# EAGLE design one_sided_standalone_DWM1000 (EAGLE 6.2)
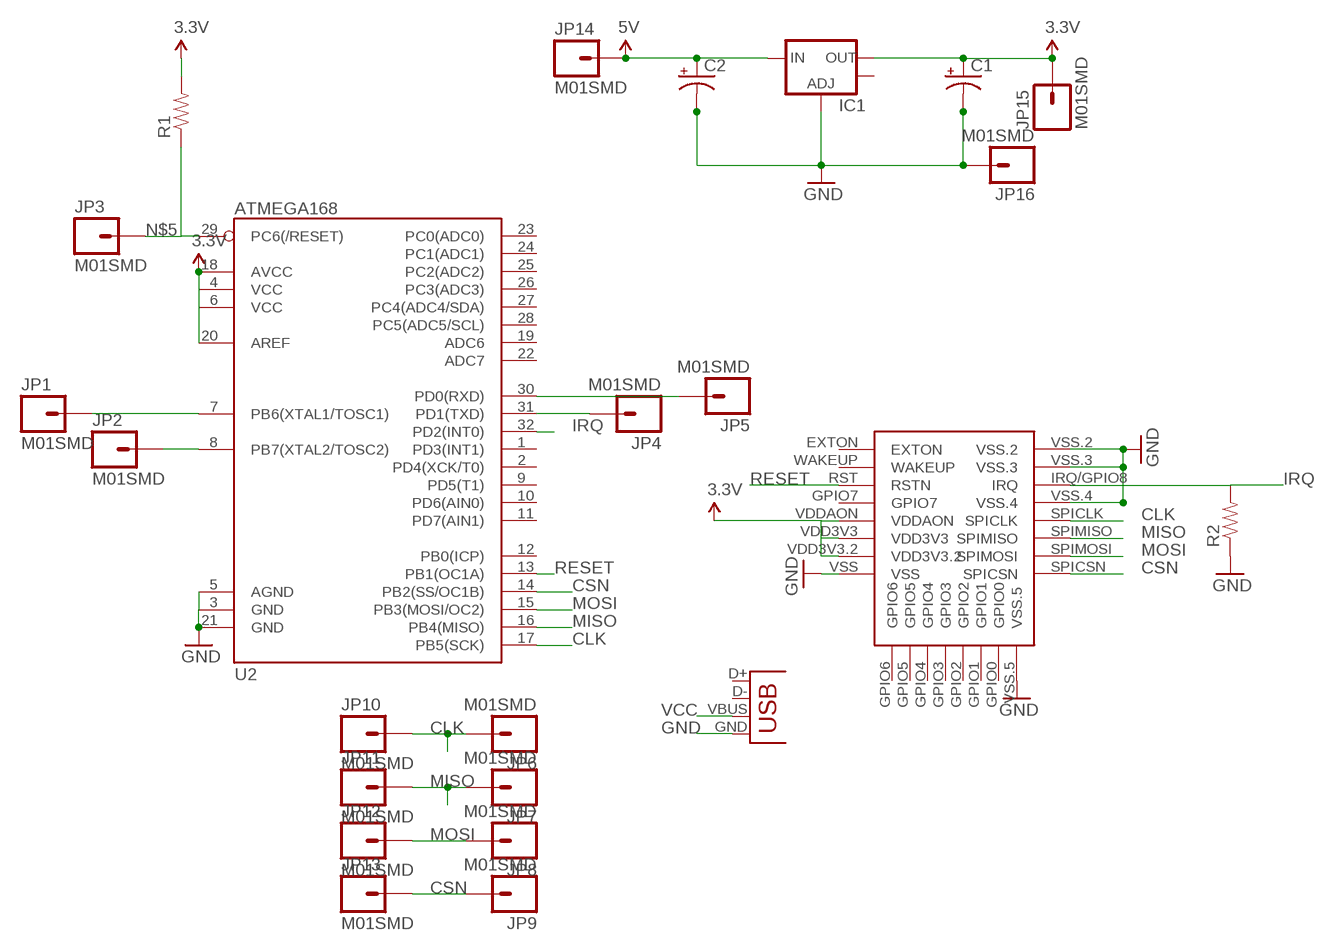
[diagram p0: schematic, sheet 1]

## Parts
C1  CAP_POL3528-KIT  [EIA3528-KIT]
C2  CAP_POL3528-KIT  [EIA3528-KIT]
IC1  V_REG_LM1117SOT223  [SOT223]
JP1  M01SMD  [LUXEON-PAD]
JP2  M01SMD  [LUXEON-PAD]
JP3  M01SMD  [LUXEON-PAD]
JP4  M01SMD  [LUXEON-PAD]
JP5  M01SMD  [LUXEON-PAD]
JP6  M01SMD  [LUXEON-PAD]
JP7  M01SMD  [LUXEON-PAD]
JP8  M01SMD  [LUXEON-PAD]
JP9  M01SMD  [LUXEON-PAD]
JP10  M01SMD  [LUXEON-PAD]
JP11  M01SMD  [LUXEON-PAD]
JP12  M01SMD  [LUXEON-PAD]
JP13  M01SMD  [LUXEON-PAD]
JP14  M01SMD  [LUXEON-PAD]
JP15  M01SMD  [LUXEON-PAD]
JP16  M01SMD  [LUXEON-PAD]
R1  RESISTOR0805-RES  [0805]
R2  RESISTOR0805-RES  [0805]
U2  ATMEGA168  [TQFP32-08]
U$1  DWM1000  [DWM1000]
X1  USB-MICROB  [USB-MICROB]

## Nets
CLK: JP6.P$1 JP10.P$1 U2.17(PB5(SCK)) U$1.SPICLK
CSN: JP9.P$1 JP13.P$1 U2.14(PB2(SS/OC1B)) U$1.SPICSN
GND: C1.C(-) C2.C(-) IC1.1(ADJ) JP16.P$1 R2.1 U2.3(GND) U2.5(AGND) U2.21(GND) U$1.VSS U$1.VSS.2 U$1.VSS.3 U$1.VSS.4 U$1.VSS.5 X1.GND
IRQ: R2.2 U2.32(PD2(INT0)) U$1.IRQ/GPIO8(IRQ)
MISO: JP7.P$1 JP11.P$1 U2.16(PB4(MISO)) U$1.SPIMISO
MOSI: JP8.P$1 JP12.P$1 U2.15(PB3(MOSI/OC2)) U$1.SPIMOSI
N$1: JP1.P$1 U2.7(PB6(XTAL1/TOSC1))
N$2: JP2.P$1 U2.8(PB7(XTAL2/TOSC2))
N$5: JP3.P$1 R1.1 U2.29(PC6(/RESET))
N$6: JP4.P$1 U2.31(PD1(TXD))
N$7: JP5.P$1 U2.30(PD0(RXD))
RESET: U2.13(PB1(OC1A)) U$1.RST(RSTN)
VCC: C2.A(+) IC1.3(IN) JP14.P$1 X1.VBUS ; supply symbol labelled 5V
VCC3.3: C1.A(+) IC1.2(OUT) JP15.P$1 R1.2 U2.6(VCC) U2.18(AVCC) U2.20(AREF) U$1.VDD3V3 U$1.VDD3V3.2 U$1.VDDAON ; supply symbol labelled 3.3V
Unconnected: IC1.4(OUT) U2.1(PD3(INT1)) U2.2(PD4(XCK/T0)) U2.4(VCC) U2.9(PD5(T1)) U2.10(PD6(AIN0)) U2.11(PD7(AIN1)) U2.12(PB0(ICP)) U2.19(ADC6) U2.22(ADC7) U2.23(PC0(ADC0)) U2.24(PC1(ADC1)) U2.25(PC2(ADC2)) U2.26(PC3(ADC3)) U2.27(PC4(ADC4/SDA)) U2.28(PC5(ADC5/SCL)) U$1.EXTON U$1.GPIO0 U$1.GPIO1 U$1.GPIO2 U$1.GPIO3 U$1.GPIO4 U$1.GPIO5 U$1.GPIO6 U$1.GPIO7 U$1.WAKEUP X1.D+ X1.D-

## Library data of the parts
C1 C2 = SparkFun:CAP_POL: Capacitor Polarized These are standard SMD and PTH capacitors. Normally 10uF, 47uF, and 100uF in electrolytic and tantalum varieties. Always verify the external diameter of the through hole cap, it varies with capacity, voltage, and manufacturer. The EIA devices should be standard.
IC1 = SparkFun:V_REG_LM1117: Voltage Regulator LM1117 Standard adjustable voltage regulator but in SMD form. Spark Fun Electronics SKU : COM-00595
JP1-JP16 = SparkFun:M01: Header 1 Standard 1-pin 0.1" header. Use with straight break away headers (SKU : PRT-00116), right angle break away headers (PRT-00553), swiss pins (PRT-00743), machine pins (PRT-00117), and female headers (PRT-00115).
R1 R2 = SparkFun:RESISTOR: Resistor Basic schematic elements and footprints for 0603, 1206, and PTH resistors.
U2 = SparkFun:ATMEGA168
U$1 = DWM1000:DWM1000
X1 = SparkFun:USB: USB Connectors USB-B-PTH is fully proven SKU : PRT-00139 USB-miniB is fully proven SKU : PRT-00587 USB-A-PCB is untested. USB-A-H is throughly reviewed, but untested. Spark Fun Electronics SKU : PRT-00437 USB-B-SMT is throughly reviewed, but untested. Needs silkscreen touching up. USB-A-S has not been used/tested USB-MB-H has not been used/tested

## Board
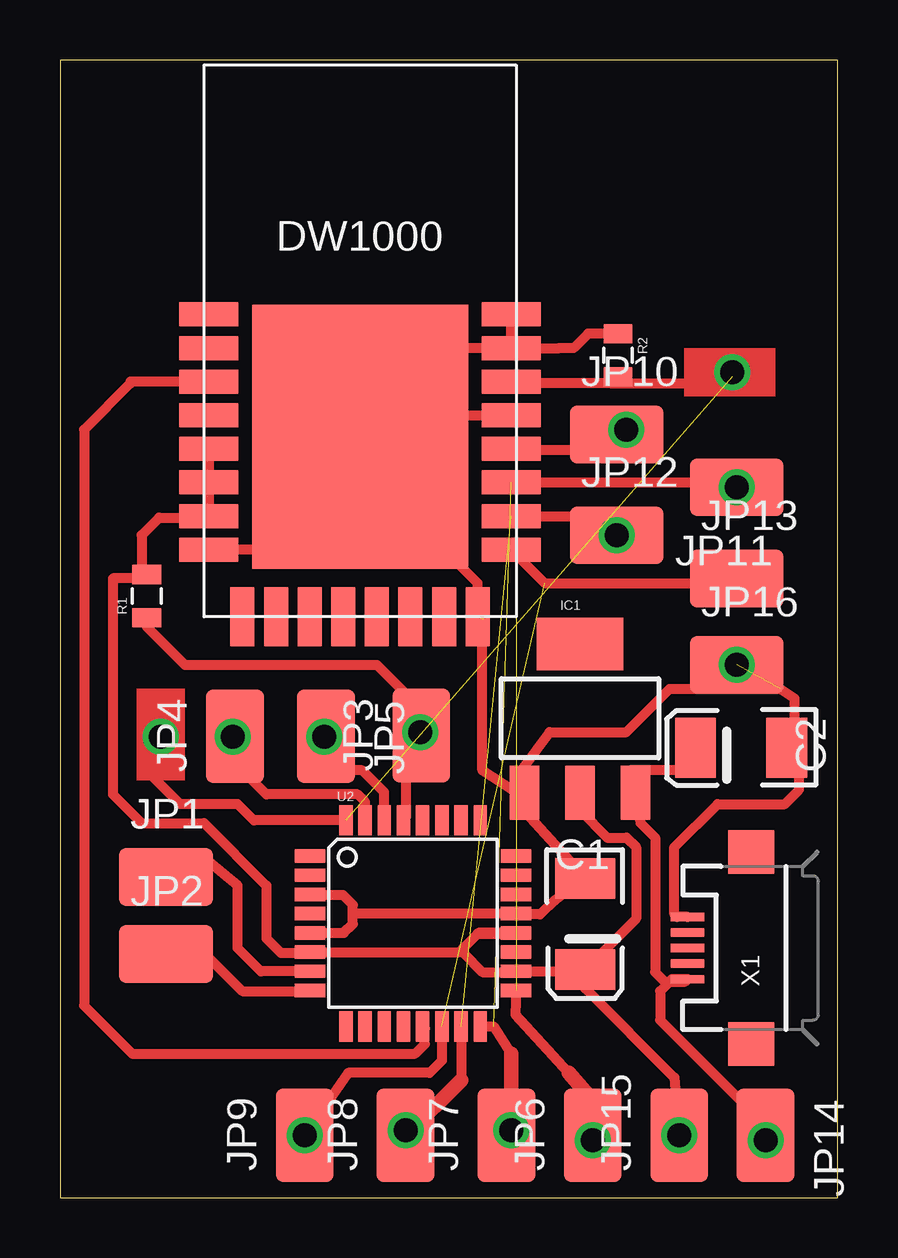
[diagram p1: board, top side]

Size 32.4 x 47.4 mm. Coordinates in mm from the lower left corner, seen from the top.
Outline: 0,0 32.4,0 32.4,47.4 0,47.4 0,0
Copper layers (1*16): Top 0.035mm / dielectric 1.5mm / Bottom 0.035mm
Design rules: minimum track width 10mil, minimum drill 24mil, track to track 8mil, track to pad 8mil, pad to pad 8mil, via to via 8mil, smd to smd 8mil, copper to edge 40mil, drill to drill 8mil, minimum pad ring 10mil, minimum via ring 8mil, stop-mask expansion 4mil, vias tented up to drill 0mil, thermal gap 10mil

### Footprints (pad centres in the part's own frame; a part is rotated, then mirrored left to right if it is on the bottom)
EIA3528-KIT = smd 1.7 x 2.5: A 1.9,0; C -1.9,0
SOT223 = smd 1.219 x 2.235: 1 -2.311,-3.099; 2 0,-3.099; 3 2.311,-3.099 | smd 3.6 x 2.2: 4 0,3.099
LUXEON-PAD = smd 3.9 x 2.4: P$1 0,0
0805 = smd 0.8 x 1.2: 1 -0.9,0; 2 0.9,0
TQFP32-08 = smd 1.27 x 0.559: 1 -4.293,2.8; 2 -4.293,2; 3 -4.293,1.2; 4 -4.293,0.4; 5 -4.293,-0.4; 6 -4.293,-1.2; 7 -4.293,-2; 8 -4.293,-2.8; 17 4.293,-2.8; 18 4.293,-2; 19 4.293,-1.2; 20 4.293,-0.4; 21 4.293,0.4; 22 4.293,1.2; 23 4.293,2; 24 4.293,2.8 | smd 0.559 x 1.27: 9 -2.8,-4.293; 10 -2,-4.293; 11 -1.2,-4.293; 12 -0.4,-4.293; 13 0.4,-4.293; 14 1.2,-4.293; 15 2,-4.293; 16 2.8,-4.293; 25 2.8,4.293; 26 2,4.293; 27 1.2,4.293; 28 0.4,4.293; 29 -0.4,4.293; 30 -1.2,4.293; 31 -2,4.293; 32 -2.8,4.293
DWM1000 = smd 2.45 x 1: EXTON -2.8,12.6; GPIO7 -2.8,8.4; IRQ/GPIO8 9.8,9.8; RST -2.8,9.8; SPICLK 9.8,7; SPICSN 9.8,2.8; SPIMISO 9.8,5.6; SPIMOSI 9.8,4.2; VDD3V3 -2.8,4.2; VDD3V3.2 -2.8,5.6; VDDAON -2.8,7; VSS -2.8,2.8; VSS.2 9.8,12.6; VSS.3 9.8,11.2; VSS.4 9.8,8.4; WAKEUP -2.8,11.2 | smd 9 x 11: GND 3.5,7.5 | smd 1 x 2.45: GPIO0 7,0; GPIO1 5.6,0; GPIO2 4.2,0; GPIO3 2.8,0; GPIO4 1.4,0; GPIO5 0,0; GPIO6 -1.4,0; VSS.5 8.4,0
USB-MICROB = smd 0.35 x 1.4: D+ 0,2.65; D- -0.65,2.65; GND 1.3,2.65; ID 0.65,2.65; VBUS -1.3,2.65 | smd 1.8 x 1.9: MT1 -4,0; MT2 4,0

### Placement (x,y rotation side)
C1  21.88,11.4 269.9 top
C2  28.38,18.74 180 top
IC1  21.67,19.97 0 top
JP1  4.42,13.36 0 top
JP2  4.42,10.15 0 top
JP3  15.05,19.25 90 top
JP4  7.29,19.22 90 top
JP5  11.08,19.22 270 top
JP6  22.2,2.6 90 top
JP7  18.6,2.6 90 top
JP8  14.4,2.6 90 top
JP9  10.2,2.6 90 top
JP10  23.2,31.8 0 top
JP11  28.2,29.6 180 top
JP12  23.2,27.6 0 top
JP13  28.2,25.8 0 top
JP14  29.4,2.6 270 top
JP15  25.8,2.6 90 top
JP16  28.2,22.2 0 top
R1  3.62,25.06 90 top
R2  23.25,35.1 270 top
U2  14.71,11.43 0 top
U$1  9,24.2 0 top
X1  28.8,10.4 90 top

### Tracks (layer width: path | path; a pad name or v marks a point on that pad's centre or on a via)
CLK  (1 unrouted)
  Top 0.406: U2.17 18.97,7.63 21.2,5.2 | 22.73,31.13 18.87,31.13 | 18.87,31.13 U$1.SPICLK | 18.87,31.13 19,31
  Top 0.61: 22.73,31.13 23.2,31.6 23.4,31.6 JP10.P$1 | 21.2,5.2 22.4,3.8 JP6.P$1
CSN  (via drill 1)  (1 unrouted)
  Top 0.406: U2.14 15.91,5.71 15.4,5.2 12,5.2 JP9.P$1 | U$1.SPICSN 20.2,25.6 28,25.6 JP13.P$1
  other vias: 10.2,2.6
GND  (via drill 1)  (2 unrouted)
  Top 0.406: R2.1 22,36 21.4,35.4 20.8,35.4 U$1.VSS.3 | U2.5 11.83,11.03 12.2,11.4 12.2,11.8 | 12.2,11.8 12.2,12.2 11.8,12.6 10.45,12.6 U2.3 | 12.2,11.8 12.23,11.83 U2.21 19.03,11.8 20,11.8 20.62,12.38 C1.C 19.38,16.05 IC1.1 19.33,16.67 | 19.33,16.67 17.6,17.8 17.6,23.81 17.64,23.85 17.64,24.12 | 19.33,16.67 19.33,17.93 20.4,19.4 23.6,19.4 25.4,21.2 30,21.2 30.6,20.8 30.6,19.42 C2.C 30.8,18.42 30.8,17 30.2,16.4 27.4,16.4 25.6,14.6 25.6,11.8 25.7,11.7 X1.GND | U$1.VSS.3 U$1.VSS.2 | U$1.VSS.5 17.4,25.6 15.2,27.8 | 15.2,27.8 9.8,27.8 9,27 U$1.VSS | U$1.VSS.3 15.8,35.4 14.6,34.2 14.6,33.4 15.4,32.6 | 15.4,32.6 U$1.VSS.4 | 15.4,32.6 15.4,28 15.2,27.8
  other vias: 28.2,22.2
IRQ  (1 unrouted)
  Top 0.406: 22.98,33.93 R2.2 | U2.32 8.08,15.72 7.4,16.4 5,16.4 3.6,17.8 | 22.98,33.93 18.87,33.93 U$1.IRQ/GPIO8 | 22.98,33.93 27.73,33.93 28,34.2
MISO  (via drill 1)  (1 unrouted)
  Top 0.406: U2.16 18.06,7.14 18.8,6 | U$1.SPIMISO 28,29.8 JP11.P$1
  Top 0.61: 28.87,29.73 JP11.P$1 | JP7.P$1 19.2,2.6 v18.8,2.8 18.8,6
  other vias: 28.2,29.6
MOSI  (via drill 1)  (1 unrouted)
  Top 0.406: U2.15 16.71,4.89 | U$1.SPIMOSI 22.4,28.4 JP12.P$1
  Top 0.61: 22.47,28.33 JP12.P$1 | 16.71,4.89 JP8.P$1
  other vias: 23.2,27.6
N$1
  Top 0.406: U2.7 8.37,9.43 7.4,10.4 7.4,13 6.2,14 5.58,14 JP1.P$1
N$2
  Top 0.406: JP2.P$1 6.05,10.15 7.6,8.6 10.39,8.6 U2.8
N$3  (via drill 1)
  other vias: 23.6,32
N$4  (via drill 1)
  other vias: 4.2,19.2
N$5
  Top 0.406: R1.1 3.62,23.78 5.2,22.2 13.2,22.2 15.2,20.2 15.2,19.4 JP3.P$1 15.05,18.05 14.4,17.4 14.4,15.81 U2.29
N$6
  Top 0.406: U2.31 12.71,16.49 12.4,16.8 8.6,16.8 7.8,17.6 7.8,18.71 JP4.P$1
N$7
  Top 0.406: U2.30 13.51,16.89 12.6,17.8 12.2,17.8 11.4,18.6 11.4,18.9 JP5.P$1
N$8  (via drill 1)
  other vias: 28,34.4
N$9  (via drill 1)
  other vias: 22.2,2.4
N$10  (via drill 1)
  other vias: 14.4,2.8
N$11  (via drill 1)
  other vias: 15,19.4
N$12  (via drill 1)
  other vias: 11,19.2
N$13  (via drill 1)
  other vias: 7.2,19.2
N$14  (via drill 1)
  other vias: 29.4,2.4
RESET
  Top 0.406: U2.13 15.2,7.05 15.2,6.4 14.8,6 3,6 1,8 1,32 2.93,33.93 2.93,34 U$1.RST
VCC
  Top 0.406: C2.A 26.94,18.4 26.8,18.4 26.82,17.82 23.78,17.82 IC1.3 24.18,15.62 24.8,15 24.8,9.4 25.2,9 26.05,9 X1.VBUS 25.5,9.1 25,8.6 25,7.4 28.6,3.8 28.6,3.4 28.8,3.2 | 29.6,4 29.4,4.2 29.2,3.6 28.8,3.2 | 28.8,3.2 JP14.P$1
VCC3.3  (via drill 1)
  Top 0.406: 3.4,25.8 3.4,27.6 4.13,28.33 6.13,28.33 U$1.VDD3V3 | 16.8,10.4 16.63,10.23 U2.6 10.39,10.2 9.2,10.2 8.6,10.8 8.6,13 6,15.6 3.4,15.6 2.2,16.8 2.2,25.8 3.4,25.8 | 17.4,11 18.97,11 U2.20 17.43,11.03 17.4,11 | 17.4,11 16.8,10.4 | 16.8,10.4 16.8,10.2 17.6,9.4 18.97,9.4 U2.18 21.81,9.43 C1.A | JP15.P$1 25.6,5 21.88,8.72 C1.A | R1.2 3.56,25.96 3.4,25.8 | IC1.2 21.67,16.13 22.8,15 23.6,15 24,14.6 24,11.62 C1.A | U$1.VDD3V3 U$1.VDD3V3.2 U$1.VDDAON U$1.VDD3V3
  other vias: 25.8,2.6
(copper drawn outside any net)
  shapes: Top area x2